# EAGLE design schematic (EAGLE 5.11)
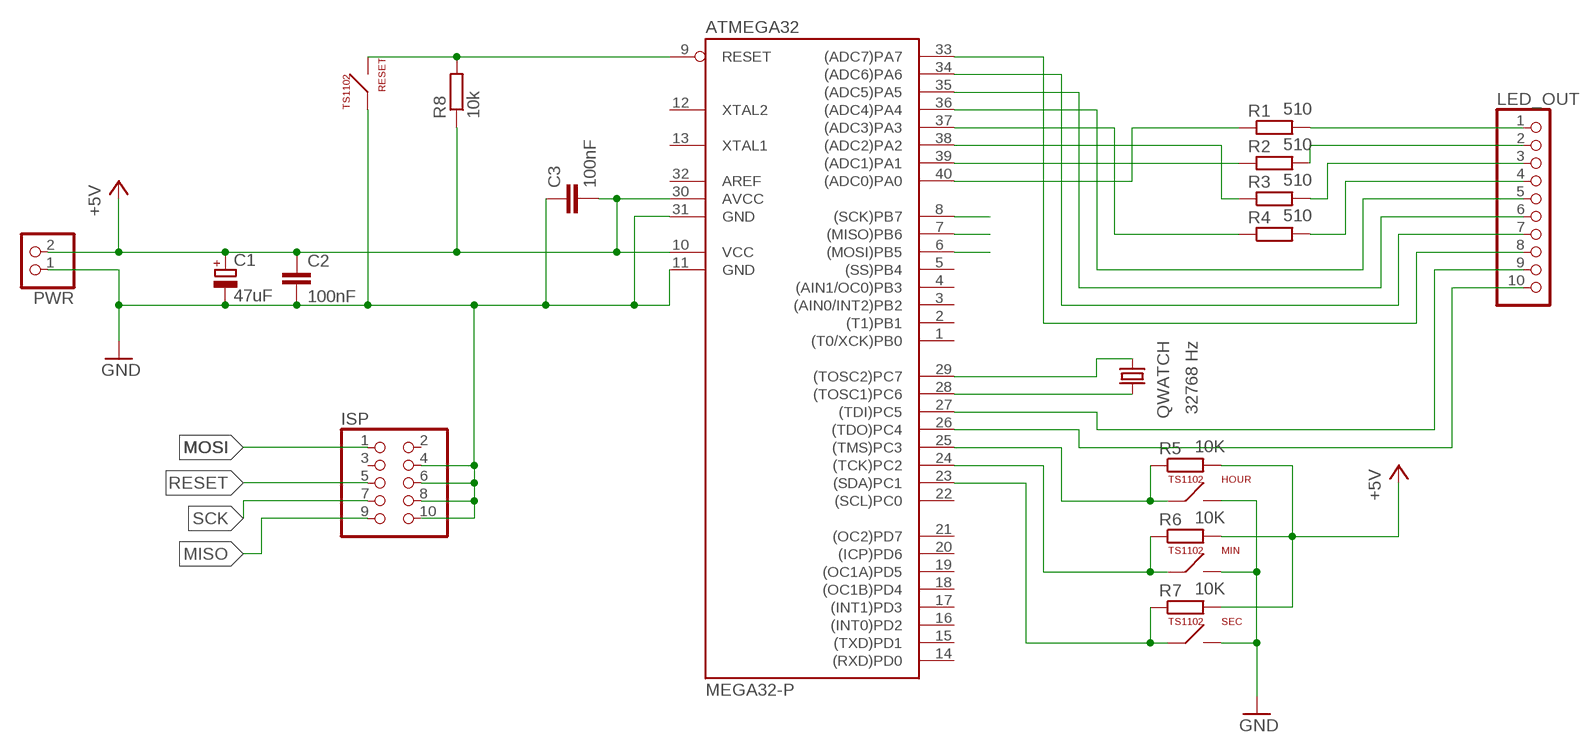
[diagram p0: schematic, sheet 1]

## Parts
ATMEGA32  MEGA32-P  [DIL40]
C1  47uF  CPOL-EUE2-4  [E2-4]
C2  100nF  C-EU050-024X044  [C050-024X044]
C3  100nF  C-EU050-024X044  [C050-024X044]
HOUR  TS1102  [TL1105]
ISP  PINHD-2X5  [2X05]
LED_OUT  PINHD-1X10  [1X10]
MIN  TS1102  [TL1105]
PWR  PINHD-1X2  [1X02]
QWATCH  32768 Hz  CRYSTALTC26H  [TC26H]
R1  510  R-EU_M1206  [M1206]
R2  510  R-EU_M1206  [M1206]
R3  510  R-EU_M1206  [M1206]
R4  510  R-EU_M1206  [M1206]
R5  10K  R-EU_0207/12  [0207/12]
R6  10K  R-EU_0207/12  [0207/12]
R7  10K  R-EU_0207/12  [0207/12]
R8  10k  R-EU_0207/12  [0207/12]
RESET  TS1102  [TL1105]
SEC  TS1102  [TL1105]

## Nets
+5V: ATMEGA32.10(VCC) ATMEGA32.30(AVCC) C1.+ C2.1 C3.2 PWR.2 R5.2 R6.2 R7.2 R8.1
GND: ATMEGA32.11(GND) ATMEGA32.31(GND) C1.- C2.2 C3.1 HOUR.2(IN2) ISP.4 ISP.6 ISP.8 ISP.10 MIN.2(IN2) PWR.1 RESET.1(IN1) SEC.2(IN2)
MISO: ATMEGA32.7((MISO)PB6) ISP.9
MOSI: ATMEGA32.6((MOSI)PB5) ISP.1
N$1: ATMEGA32.28((TOSC1)PC6) QWATCH.2
N$2: ATMEGA32.29((TOSC2)PC7) QWATCH.1
N$3: LED_OUT.1 R1.2
N$4: LED_OUT.2 R2.2
N$5: LED_OUT.3 R3.2
N$6: LED_OUT.4 R4.2
N$7: ATMEGA32.40((ADC0)PA0) R1.1
N$8: ATMEGA32.39((ADC1)PA1) R2.1
N$9: ATMEGA32.38((ADC2)PA2) R3.1
N$10: ATMEGA32.37((ADC3)PA3) R4.1
N$11: ATMEGA32.36((ADC4)PA4) LED_OUT.5
N$12: ATMEGA32.35((ADC5)PA5) LED_OUT.6
N$13: ATMEGA32.34((ADC6)PA6) LED_OUT.7
N$14: ATMEGA32.33((ADC7)PA7) LED_OUT.8
N$15: ATMEGA32.27((TDI)PC5) LED_OUT.9
N$16: ATMEGA32.26((TDO)PC4) LED_OUT.10
N$17: ATMEGA32.25((TMS)PC3) HOUR.1(IN1) R5.1
N$18: ATMEGA32.24((TCK)PC2) MIN.1(IN1) R6.1
N$19: ATMEGA32.23((SDA)PC1) R7.1 SEC.1(IN1)
RESET: ATMEGA32.9(RESET) ISP.5 R8.2 RESET.2(IN2)
SCK: ATMEGA32.8((SCK)PB7) ISP.7
Unconnected: ATMEGA32.1((T0/XCK)PB0) ATMEGA32.2((T1)PB1) ATMEGA32.3((AIN0/INT2)PB2) ATMEGA32.4((AIN1/OC0)PB3) ATMEGA32.5((SS)PB4) ATMEGA32.12(XTAL2) ATMEGA32.13(XTAL1) ATMEGA32.14((RXD)PD0) ATMEGA32.15((TXD)PD1) ATMEGA32.16((INT0)PD2) ATMEGA32.17((INT1)PD3) ATMEGA32.18((OC1B)PD4) ATMEGA32.19((OC1A)PD5) ATMEGA32.20((ICP)PD6) ATMEGA32.21((OC2)PD7) ATMEGA32.22((SCL)PC0) ATMEGA32.32(AREF) ISP.2 ISP.3

## Library data of the parts
ATMEGA32 = atmel:MEGA32-P: MICROCONTROLLER 32 Kbytes FLASH 2 Kbytes SRAM 1 Kbytes EEPROM USART 8-channel 10 bit ADC Source: www.atmel.com .. doc2503.pdf
C1 = rcl:CPOL-EU: POLARIZED CAPACITOR, European symbol
C2 C3 = rcl:C-EU: CAPACITOR, European symbol
HOUR MIN RESET SEC = mylib:TS1102
ISP = pinhead:PINHD-2X5: PIN HEADER
LED_OUT = pinhead:PINHD-1X10: PIN HEADER
PWR = pinhead:PINHD-1X2: PIN HEADER
QWATCH = crystal:CRYSTAL: CRYSTAL
R1-R8 = rcl:R-EU_: RESISTOR, European symbol

## Board
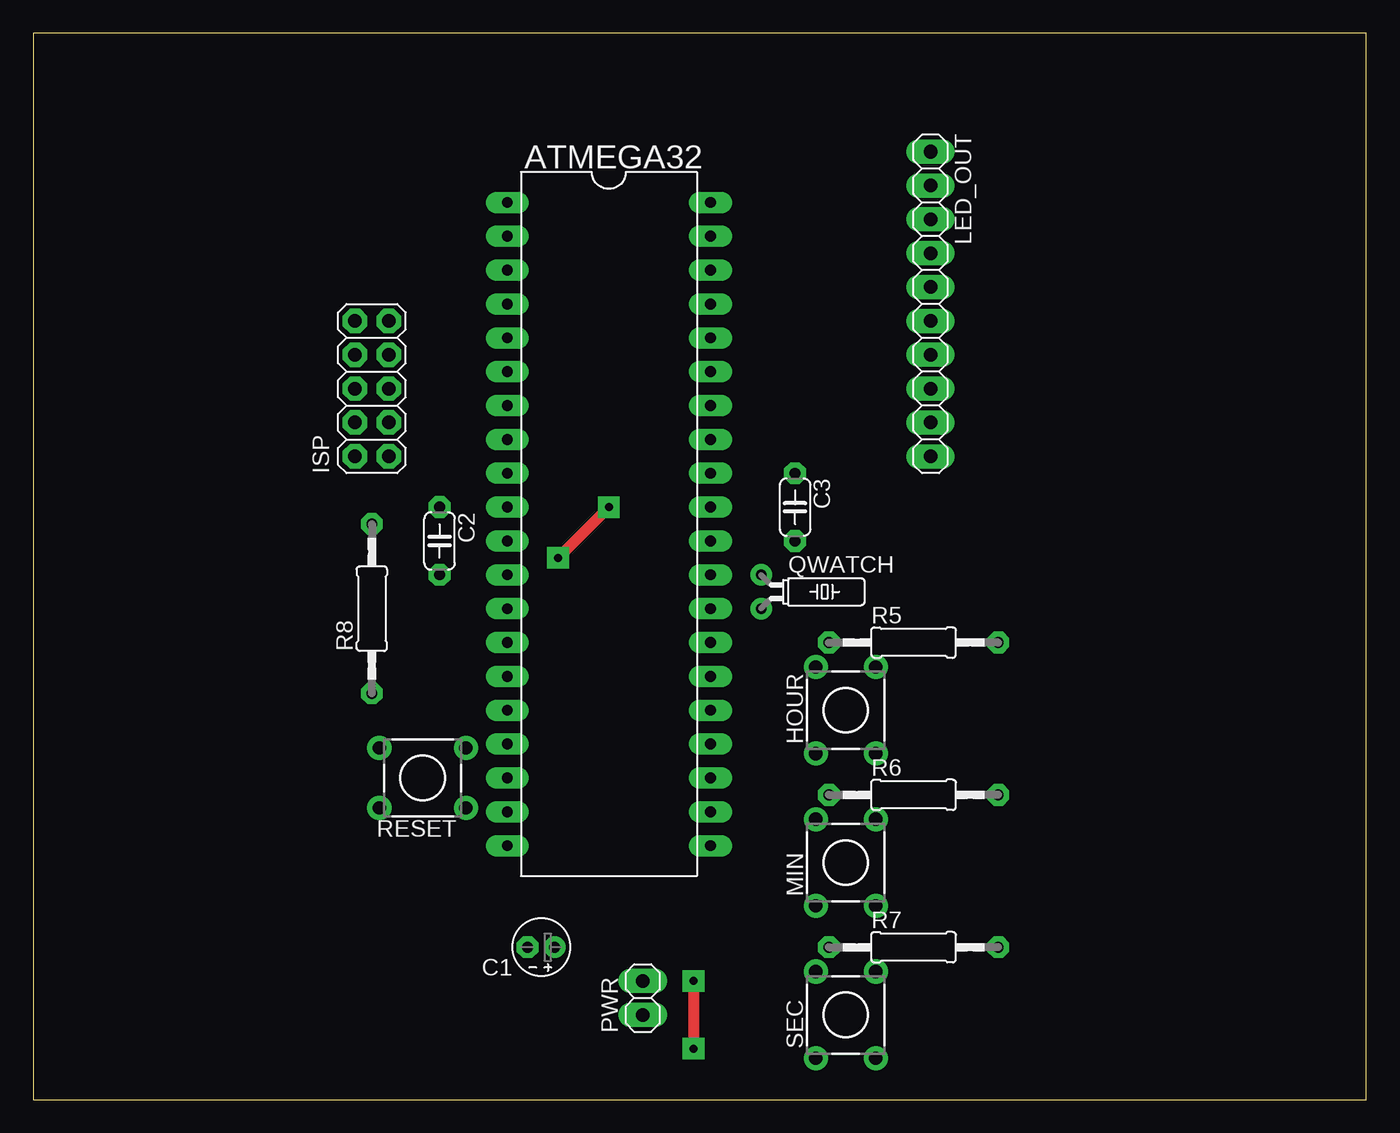
[diagram p1: board, top side]
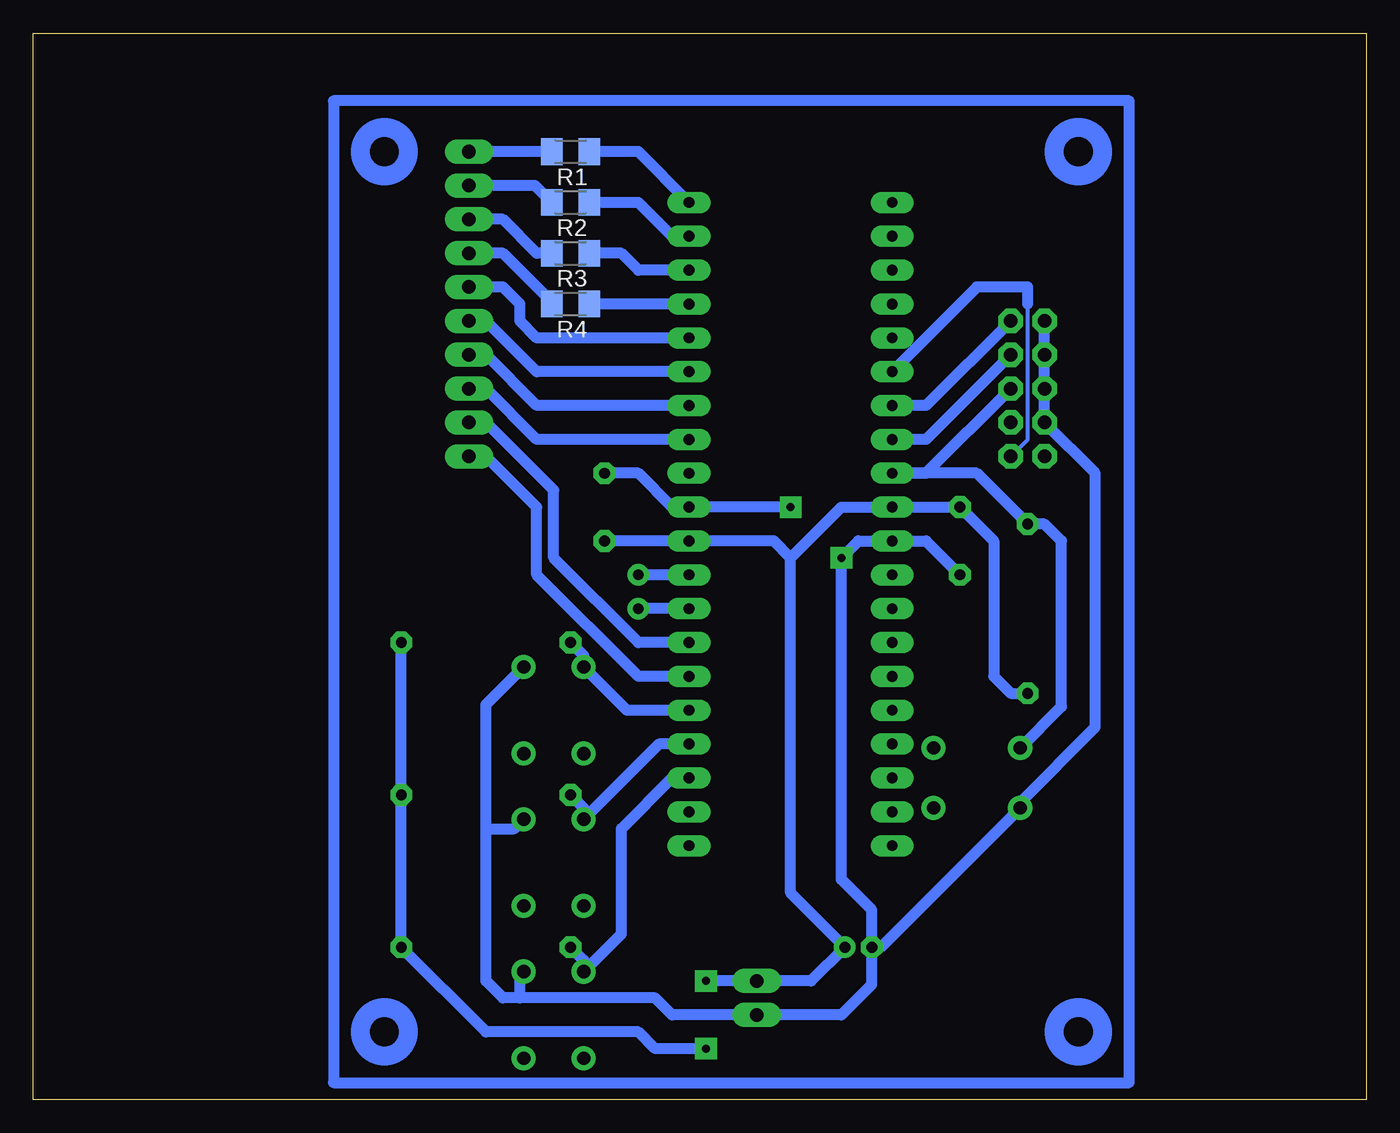
[diagram p2: board, bottom side, seen from below]

Size 100 x 80 mm. Coordinates in mm from the lower left corner, seen from the top.
Outline: 0,0 100,0 100,80 0,80 0,0
Copper layers (1*16): Top 0.035mm / dielectric 1.5mm / Bottom 0.035mm
Design rules "default *": minimum track width 10mil, minimum drill 15mil, track to track 8mil, track to pad 8mil, pad to pad 8mil, via to via 8mil, smd to smd 8mil, copper to edge 40mil, drill to drill 8mil, minimum pad ring 16mil, minimum via ring 20mil, stop-mask expansion 4mil, vias tented up to drill 0mil, thermal gap 10mil

### Footprints (pad centres in the part's own frame; a part is rotated, then mirrored left to right if it is on the bottom)
DIL40 = drill 0.813 long: 1 -24.13,-7.62; 2 -21.59,-7.62; 3 -19.05,-7.62; 4 -16.51,-7.62; 5 -13.97,-7.62; 6 -11.43,-7.62; 7 -8.89,-7.62; 8 -6.35,-7.62; 9 -3.81,-7.62; 10 -1.27,-7.62; 11 1.27,-7.62; 12 3.81,-7.62; 13 6.35,-7.62; 14 8.89,-7.62; 15 11.43,-7.62; 16 13.97,-7.62; 17 16.51,-7.62; 18 19.05,-7.62; 19 21.59,-7.62; 20 24.13,-7.62; 21 24.13,7.62; 22 21.59,7.62; 23 19.05,7.62; 24 16.51,7.62; 25 13.97,7.62; 26 11.43,7.62; 27 8.89,7.62; 28 6.35,7.62; 29 3.81,7.62; 30 1.27,7.62; 31 -1.27,7.62; 32 -3.81,7.62; 33 -6.35,7.62; 34 -8.89,7.62; 35 -11.43,7.62; 36 -13.97,7.62; 37 -16.51,7.62; 38 -19.05,7.62; 39 -21.59,7.62; 40 -24.13,7.62
E2-4 = drill 0.813 pad 1.27 round: + -1.016,0 | drill 0.813 pad 1.27 octagon: - 1.016,0
C050-024X044 = drill 0.813 octagon: 1 -2.54,0; 2 2.54,0
TL1105 = drill 1 pad 1.676 round: 1 -2.25,3.25; 2 2.25,3.25; 3 -2.25,-3.25; 4 2.25,-3.25
2X05 = drill 1.016 octagon: 1 -5.08,-1.27; 2 -5.08,1.27; 3 -2.54,-1.27; 4 -2.54,1.27; 5 0,-1.27; 6 0,1.27; 7 2.54,-1.27; 8 2.54,1.27; 9 5.08,-1.27; 10 5.08,1.27
1X10 = drill 1.016 long: 1 -11.43,0; 2 -8.89,0; 3 -6.35,0; 4 -3.81,0; 5 -1.27,0; 6 1.27,0; 7 3.81,0; 8 6.35,0; 9 8.89,0; 10 11.43,0
1X02 = drill 1.016 long: 1 -1.27,0; 2 1.27,0
TC26H = drill 0.813 round: 1 -1.27,0; 2 1.27,0
M1206 = smd 1.6 x 2: 1 -1.4,0; 2 1.4,0
0207/12 = drill 0.813 octagon: 1 -6.35,0; 2 6.35,0

### Placement (x,y rotation side)
ATMEGA32  43.18,43.18 270 top
C1  38.1,11.43 180 top
C2  30.48,41.91 270 top
C3  57.15,44.45 270 top
HOUR  60.96,29.21 0 top
ISP  25.4,53.34 90 top
LED_OUT  67.31,59.69 270 top
MIN  60.96,17.78 0 top
PWR  45.72,7.62 90 top
QWATCH  54.61,38.1 270 top
R1  59.69,71.12 180 bottom
R2  59.69,67.31 180 bottom
R3  59.69,63.5 180 bottom
R4  59.69,59.69 180 bottom
R5  66.04,34.29 0 top
R6  66.04,22.86 0 top
R7  66.04,11.43 0 top
R8  25.4,36.83 90 top
RESET  29.21,24.13 90 top
SEC  60.96,6.35 0 top

### Tracks (layer width: path | path; a pad name or v marks a point on that pad's centre or on a via)
+5V  (via drill 0.6)
  Top 0.813: v49.53,8.89 v49.53,3.81
  Bottom 0.813: C3.2 ATMEGA32.30 44.45,41.91 43.18,40.64 | R7.2 R6.2 R5.2 R7.2 | 43.18,40.64 39.37,44.45 ATMEGA32.10 C2.1 27.94,41.91 27.94,31.75 26.67,30.48 R8.1 | 43.18,40.64 43.18,15.49 C1.+ 41.66,8.89 PWR.2 v49.53,8.89 | R7.2 66.04,5.08 54.61,5.08 53.34,3.81 v49.53,3.81
GND  (via drill 0.6)
  Top 0.813: v39.37,40.64 v43.18,44.45
  Bottom 0.813: C3.1 54.61,46.99 52.07,44.45 ATMEGA32.31 v43.18,44.45 | ISP.10 ISP.8 ISP.6 ISP.4 20.32,46.99 20.32,27.94 25.96,22.3 RESET.1 36.41,11.43 C1.- | C2.2 33.02,41.91 ATMEGA32.11 38.1,41.91 v39.37,40.64 39.37,16.51 37.08,14.22 C1.- | HOUR.2 66.04,29.63 66.04,20.32 | 66.04,20.32 66.04,8.89 64.77,7.62 63.5,7.62 | 63.5,7.62 53.34,7.62 52.07,6.35 PWR.1 39.37,6.35 37.08,8.64 C1.- | MIN.2 63.92,20.32 66.04,20.32 | SEC.2 63.5,9.31 63.5,7.62
MISO
  Bottom 0.813: ATMEGA32.7 33.02,52.07 ISP.9
MOSI
  Bottom 0.305: 25.4,59.69 25.4,49.53 ISP.1
  Bottom 0.813: ATMEGA32.6 29.21,60.96 25.4,60.96 25.4,59.69
N$1
  Bottom 0.813: ATMEGA32.28 QWATCH.2
N$2
  Bottom 0.813: ATMEGA32.29 QWATCH.1
N$3
  Bottom 0.813: R1.2 LED_OUT.1
N$4
  Bottom 0.813: R2.2 62.36,68.58 LED_OUT.2
N$5
  Bottom 0.813: R3.2 62.23,63.5 64.77,66.04 LED_OUT.3
N$6
  Bottom 0.813: R4.2 61.09,59.82 64.77,63.5 LED_OUT.4
N$7
  Bottom 0.813: ATMEGA32.40 54.61,71.12 R1.1
N$8
  Bottom 0.813: ATMEGA32.39 52.07,64.77 54.61,67.31 R2.1
N$9
  Bottom 0.813: ATMEGA32.38 54.61,62.23 55.88,63.5 R3.1
N$10
  Bottom 0.813: ATMEGA32.37 R4.1
N$11
  Bottom 0.813: LED_OUT.5 64.77,60.96 63.5,59.69 63.5,58.42 62.23,57.15 ATMEGA32.36
N$12
  Bottom 0.813: LED_OUT.6 66.04,58.42 62.23,54.61 ATMEGA32.35
N$13
  Bottom 0.813: ATMEGA32.34 62.23,52.07 66.04,55.88 LED_OUT.7
N$14
  Bottom 0.813: ATMEGA32.33 62.23,49.53 66.04,53.34 LED_OUT.8
N$15
  Bottom 0.813: ATMEGA32.27 54.61,34.29 60.96,40.64 60.96,45.72 66.04,50.8 LED_OUT.9
N$16
  Bottom 0.813: ATMEGA32.26 54.61,31.75 62.23,39.37 62.23,44.45 66.04,48.26 LED_OUT.10
N$17
  Bottom 0.813: ATMEGA32.25 55.46,29.21 HOUR.1 58.71,33.31 R5.1
N$18
  Bottom 0.813: ATMEGA32.24 53.07,26.67 MIN.1 58.71,21.88 R6.1
N$19
  Bottom 0.813: ATMEGA32.23 52.07,24.13 55.88,20.32 55.88,12.43 SEC.1 58.71,10.45 R7.1
N$20
  Bottom 0.813: 77.47,1.27 17.78,1.27 17.78,74.93 77.47,74.93 77.47,1.27
RESET
  Bottom 0.813: ISP.5 33.02,46.99 ATMEGA32.9 29.21,46.99 R8.2 24.13,43.18 22.86,41.91 22.86,29.48 RESET.2
SCK
  Bottom 0.813: ATMEGA32.8 33.02,49.53 ISP.7
(copper drawn outside any net)
  shapes: Bottom circle x4